# EAGLE schematic power supply for AOM (EAGLE 7.7.0)
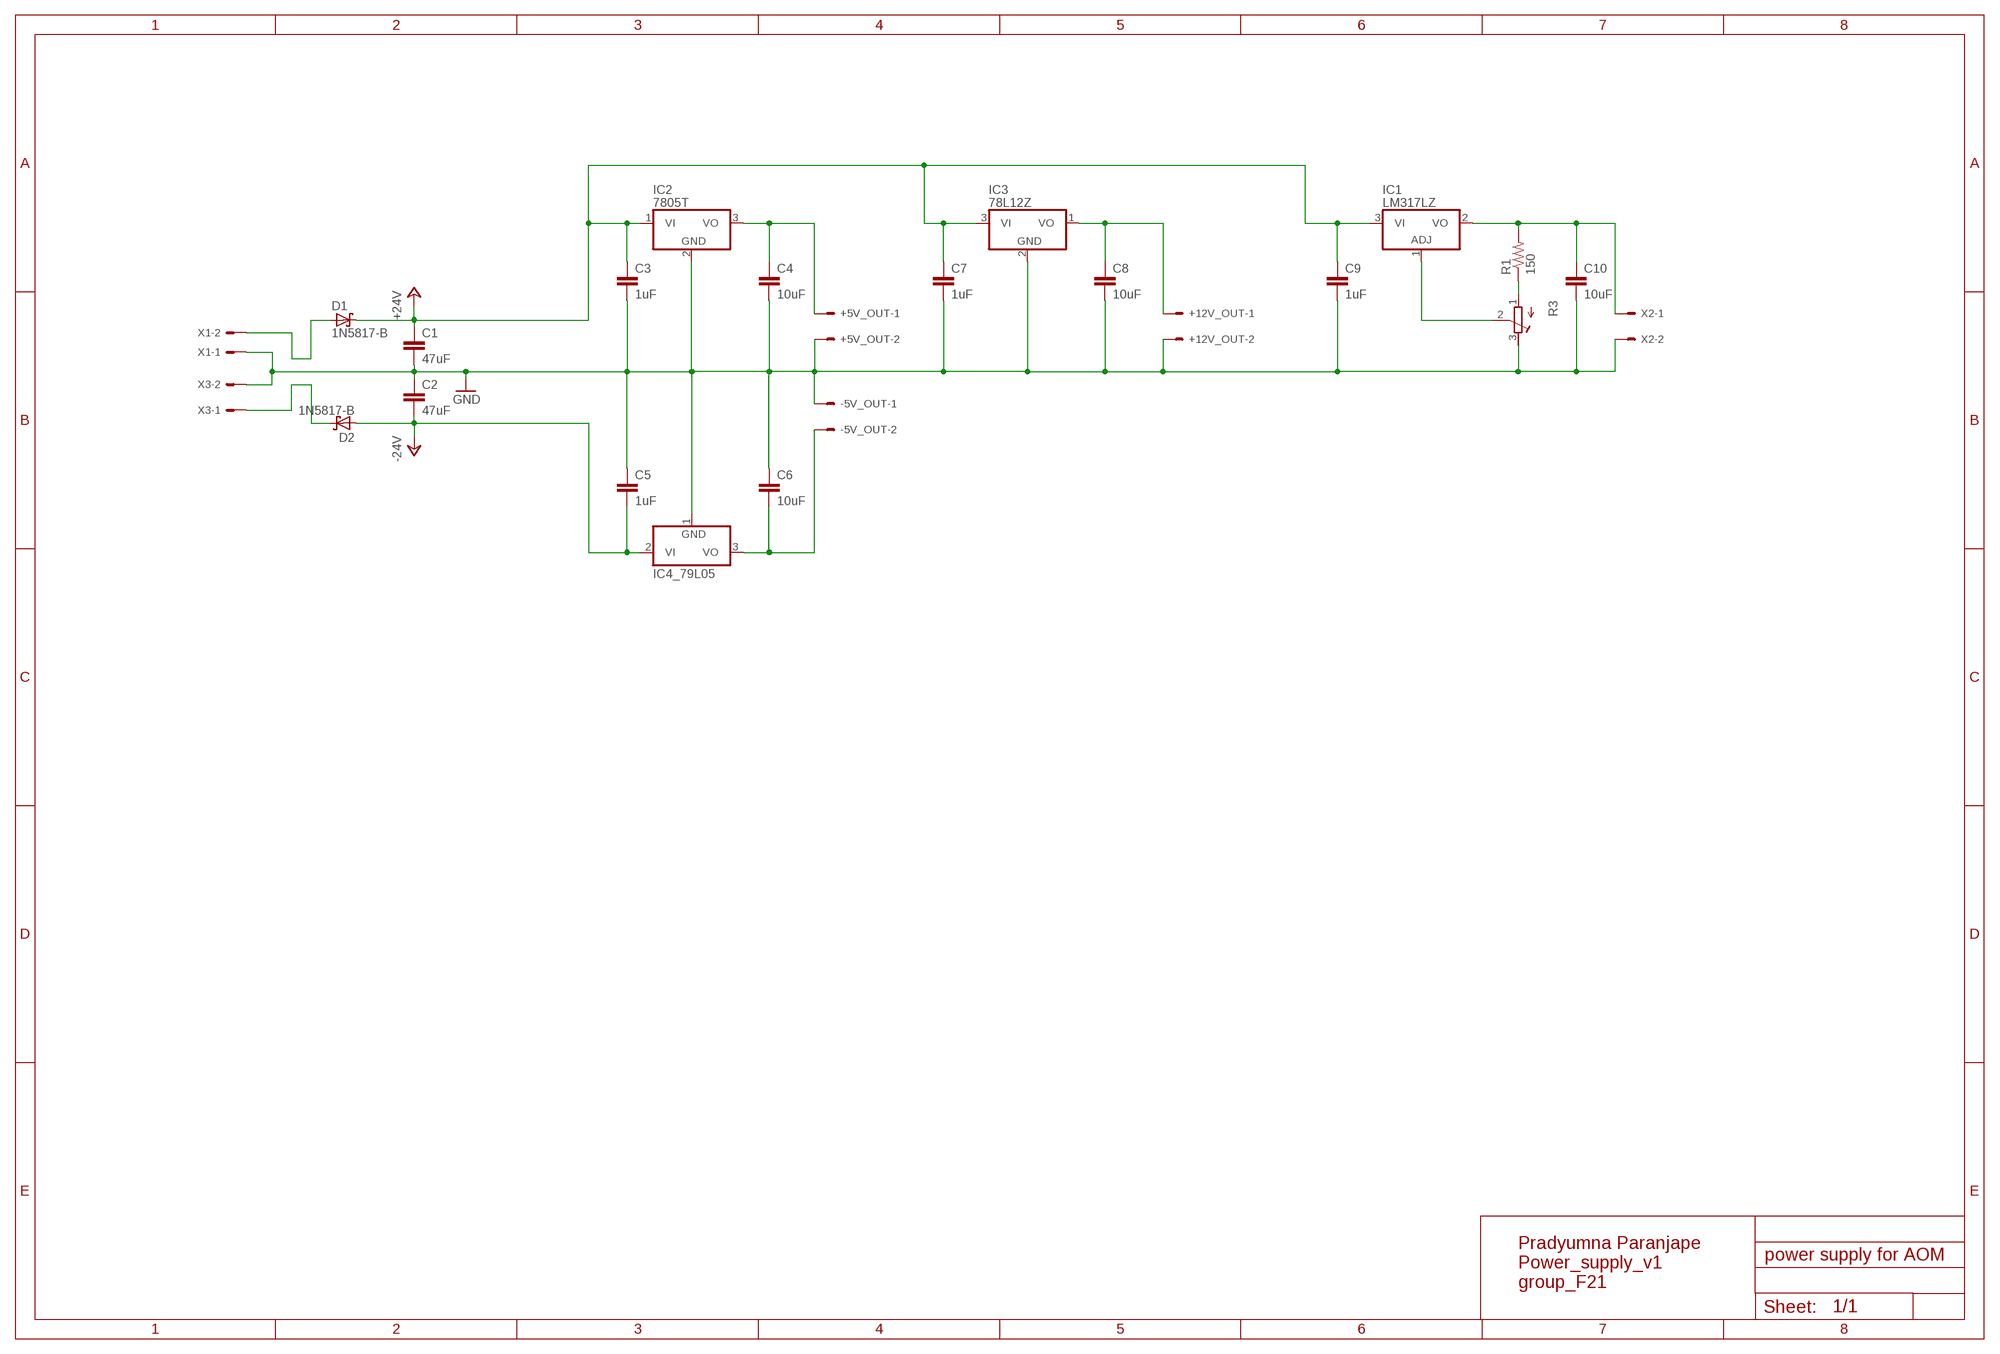
[diagram p0: schematic, sheet 1]

## Parts
+5V_OUT  KK-156-2  [KK-156-2]
+12V_OUT  KK-156-2  [KK-156-2]
-5V_OUT  KK-156-2  [KK-156-2]
C1  47uF  C-EU050-025X075  [C050-025X075]
C2  47uF  C-EU050-025X075  [C050-025X075]
C3  1uF  C-EU050-025X075  [C050-025X075]
C4  10uF  C-EU050-025X075  [C050-025X075]
C5  1uF  C-EU050-025X075  [C050-025X075]
C6  10uF  C-EU050-025X075  [C050-025X075]
C7  1uF  C-EU050-025X075  [C050-025X075]
C8  10uF  C-EU050-025X075  [C050-025X075]
C9  1uF  C-EU050-025X075  [C050-025X075]
C10  10uF  C-EU050-025X075  [C050-025X075]
D1  1N5817-B  [DO41-7.6]
D2  1N5817-B  [DO41-7.6]
IC1  LM317LZ  [TO92]
IC2  7805T  [TO220H]
IC3  78L12Z  [TO92]
IC4_79L05  7905L  [TO92]
R1  150  R-US_0207/10  [0207/10]
R3  R-TRIMM3296Y  [RTRIM3296Y]
X1  KK-156-2  [KK-156-2]
X2  KK-156-2  [KK-156-2]
X3  KK-156-2  [KK-156-2]

## Nets
+24V: C1.1 C3.1 C7.1 C9.1 D1.C IC1.3(VI) IC2.1(VI) IC3.3(VI)
-24V: C2.2 C5.2 D2.A IC4_79L05.2(VI)
GND: +5V_OUT.2 +12V_OUT.2 -5V_OUT.1 C1.2 C2.1 C3.2 C4.2 C5.1 C6.1 C7.2 C8.2 C9.2 C10.2 IC2.2(GND) IC3.2(GND) IC4_79L05.1(GND) R3.3(E) X1.1 X2.2 X3.2
N$1: D2.C X3.1
N$2: D1.A X1.2
N$3: +12V_OUT.1 C8.1 IC3.1(VO)
N$4: +5V_OUT.1 C4.1 IC2.3(VO)
N$5: -5V_OUT.2 C6.2 IC4_79L05.3(VO)
N$6: R1.1 R3.1(A)
N$7: IC1.1(ADJ) R3.2(S)
N$8: C10.1 IC1.2(VO) R1.2 X2.1

## Notes on the sheet
- Pradyumna Paranjape
  Power_supply_v1
  group_F21

## Library data of the parts
+5V_OUT +12V_OUT -5V_OUT X1-X3 = con-molex:KK-156-2: KK 156 HEADER Source: http://www.molex.com/pdm_docs/sd/026604100_sd.pdf; OC_FARNELL: unknown; OC_NEWARK: unknown
C1-C10 = rcl:C-EU: CAPACITOR, European symbol
D1 D2 = diode:1N581*: 1.0A SCHOTTKY BARRIER RECTIFIER Source: http://www.diodes.com/datasheets/ds23001.pdf
IC1 = linear:*317: Positive VOLTAGE REGULATOR
IC2 IC3 = linear:78*: Positive VOLTAGE REGULATOR Source: http://cache.national.com/ds/LM/LM78L05.pdf http://www.fairchildsemi.com/ds/LM/LM7805.pdf
IC4_79L05 = linear:79*: Negative VOLTAGE REGULATOR
R1 = rcl:R-US_: RESISTOR, American symbol
R3 = rcl:R-TRIMM: Trimm resistor

## Net classes
0 default: width 0.381 mm, drill 0.254 mm, clearance 0.254 mm